# Altium project TestLib.PrjPcb
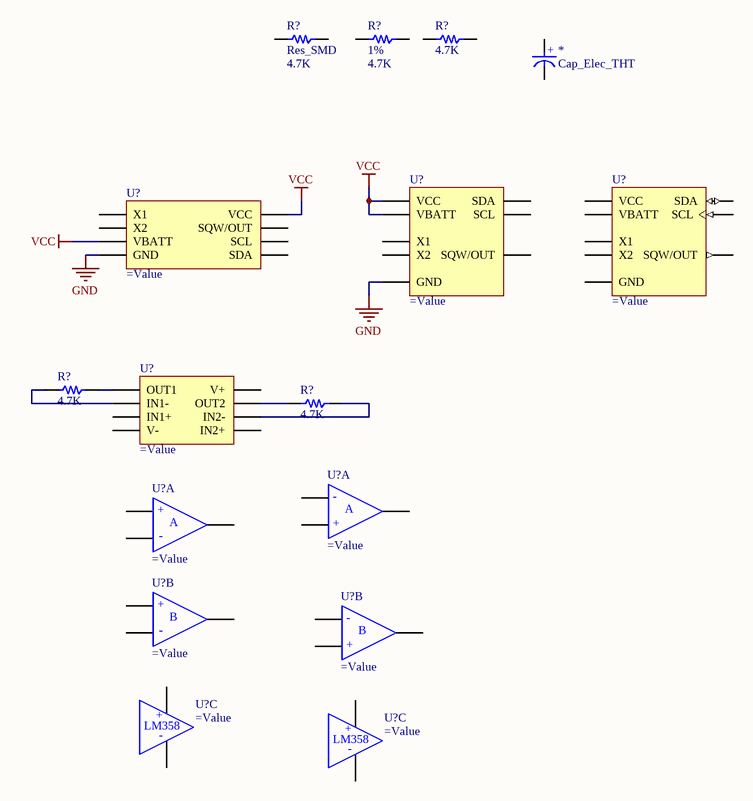
[diagram p0: Sheet1.SchDoc]
1 sheet, 16 parts. Net scope: global (net labels, ports and power ports of the same name join across sheets).
Board file: PCB1.PcbDoc

## Sheet Sheet1.SchDoc
size A4; SheetNumber: 1; SheetTotal: 1

### Parts
(Parts that share a designator on the sheet are numbered #1, #2 ... from top to bottom, then left to right.)
*  Cap_Elec_THT
R?#1  Res_SMD  value 4.7K  [Res_SMD_0805]
R?#2  1%  value 4.7K  [Res_SMD_0805]
R?#3  value 4.7K  [Res_SMD_0805]  (hidden comment: LED Blue)
R?#4  4.7K  [Res_SMD_0805]
R?#5  4.7K  [Res_SMD_0805]
U?#1  (no value)  [PDIP-8]
U?#2  (no value)  [PDIP-8]
U?#3  (no value)  [PDIP-8]
U?#4  (no value)  [PDIP-8]
U?#5  (no value)  [PDIP-8]  (part A of 3)
U?#6  (no value)  [SOIC-8]  (part A of 3)
U?#7  (no value)  [SOIC-8]  (part B of 3)
U?#8  (no value)  [PDIP-8]  (part B of 3)
U?#9  (no value)  [SOIC-8]  (part C of 3)
U?#10  (no value)  [PDIP-8]  (part C of 3)

### Nets
GND: U?#1.4(GND) U?#3.4(GND)
VCC: U?#1.3(VBATT) U?#1.8(VCC) U?#3.3(VBATT) U?#3.8(VCC)
NetR?#4_1: R?#4.1 U?#4.2(IN1-)
NetR?#4_2: R?#4.2 U?#4.1(OUT1)
NetR?#5_1: R?#5.1 U?#4.7(OUT2)
NetR?#5_2: R?#5.2 U?#4.6(IN2-)

Not connected (* = marked no-connect by the designer): * N(Negative) P(Positvie); R?#1 1 2; R?#2 1 2; R?#3 1 2; U?#1 1(X1) 2(X2) 5(SDA) 6(SCL) 7(SQW/OUT); U?#2 1(X1) 2(X2) 3(VBATT) 4(GND) 5(SDA) 6(SCL) 7(SQW/OUT) 8(VCC); U?#3 1(X1) 2(X2) 5(SDA) 6(SCL) 7(SQW/OUT); U?#4 3(IN1+) 4(V-) 5(IN2+) 8(V+); U?#5 1(OUT1) 2(IN1-) 3(IN1+); U?#6 1(OUT1) 2(IN1-) 3(IN1+); U?#7 5(IN2+) 6(IN2-) 7(OUT2); U?#8 5(IN2+) 6(IN2-) 7(OUT2); U?#9 4(V-) 8(V+); U?#10 4(V-) 8(V+)

### Notes on the sheet
- (in symbol Cap_Elec_THT) +
- (in symbol IC_OpAmp_LM358, part A) +; A; -
- (in symbol IC_OpAmp_LM358, part B) +; B; -
- (in symbol IC_OpAmp_LM358, part C) +; LM358; -

### Library data of the parts
R?#1-R?#5 = Res_SMD: Rating: 0.125W; Type: 1%; Package: 0805
  R?#4 R?#5: Value: 4.7K
U?#1-U?#3 = IC_RTC_DS1307
U?#4-U?#10 = IC_OpAmp_LM358